# Altium schematic sheet IPMC_V71V01.SchDoc
size A2; SheetNumber: 1; SheetTotal: 1
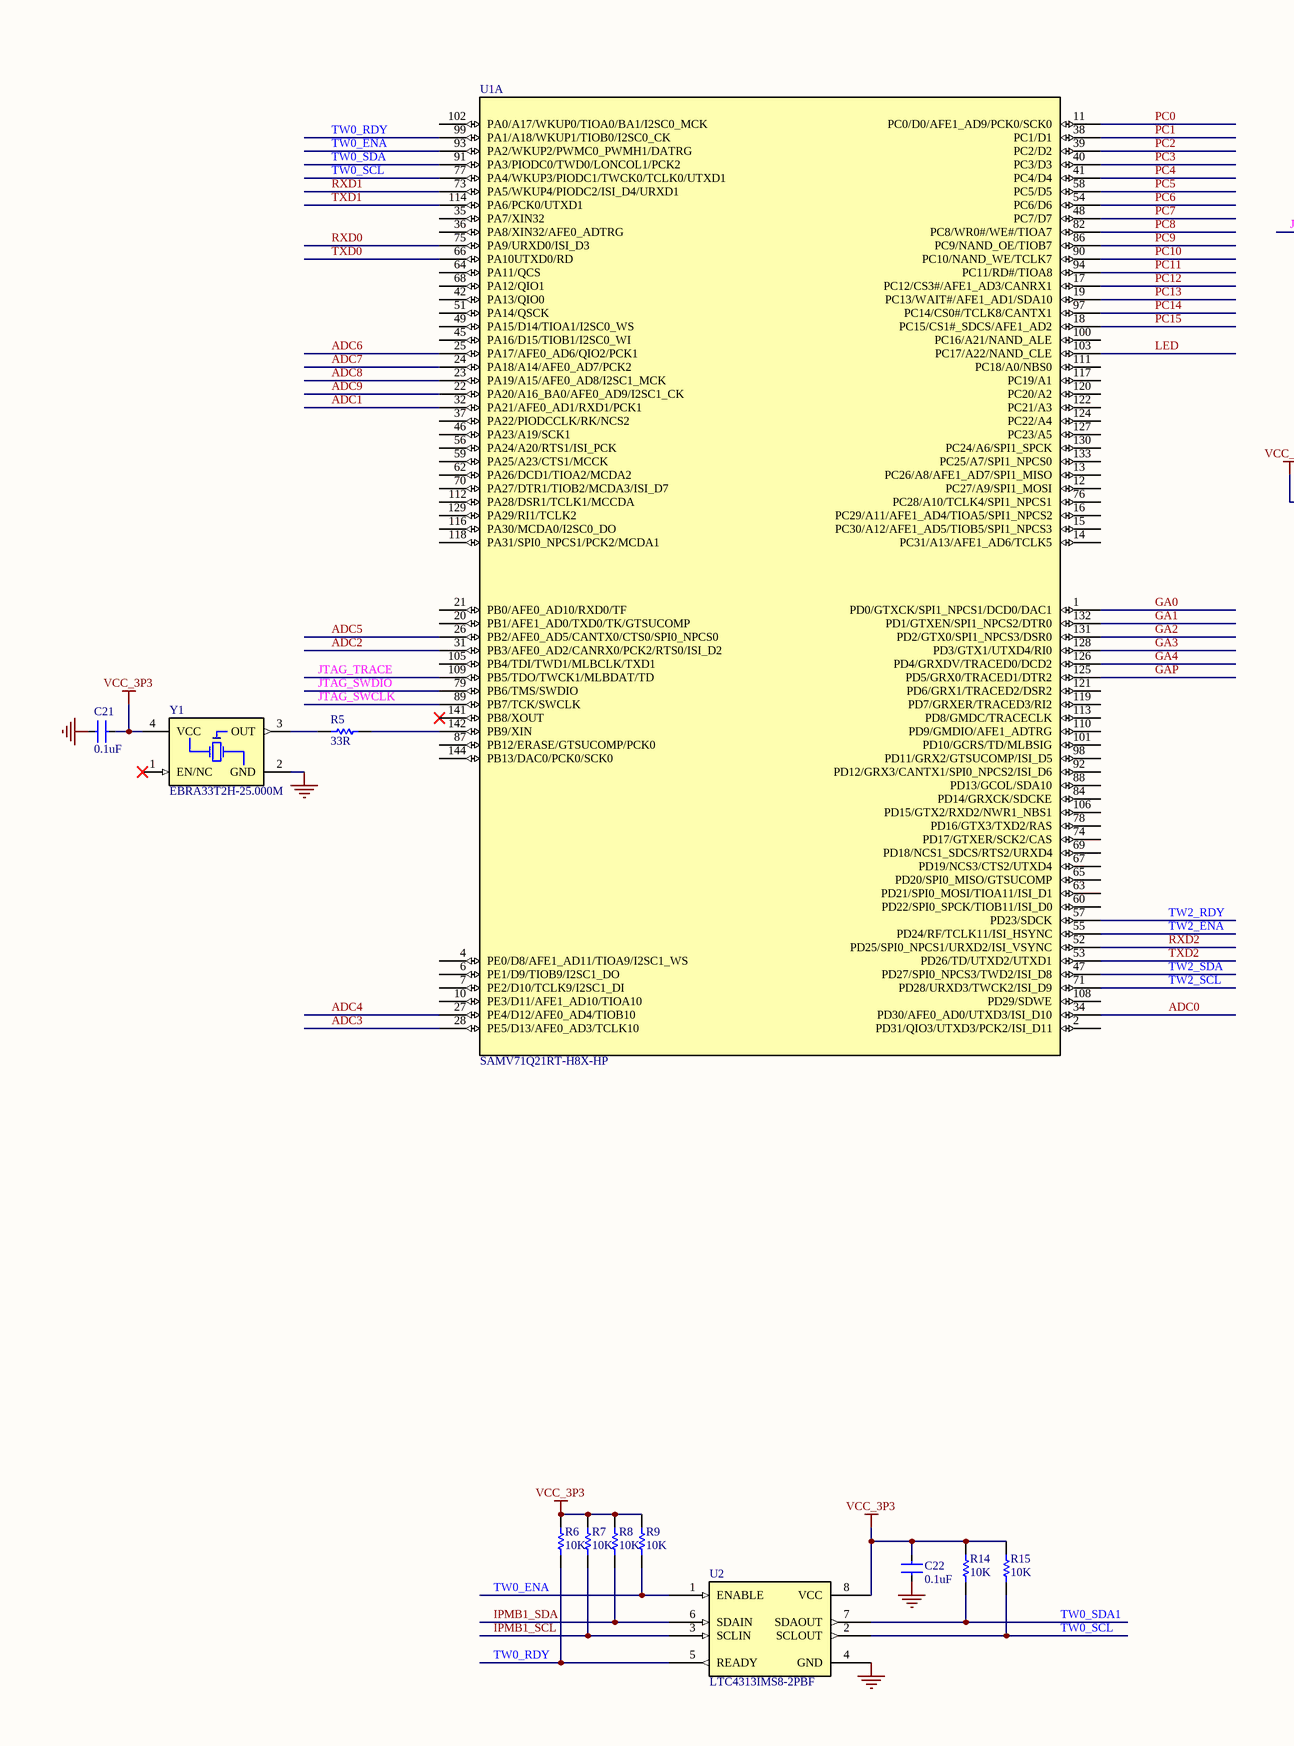
[diagram p0: IPMC_V71V01.SchDoc, left]
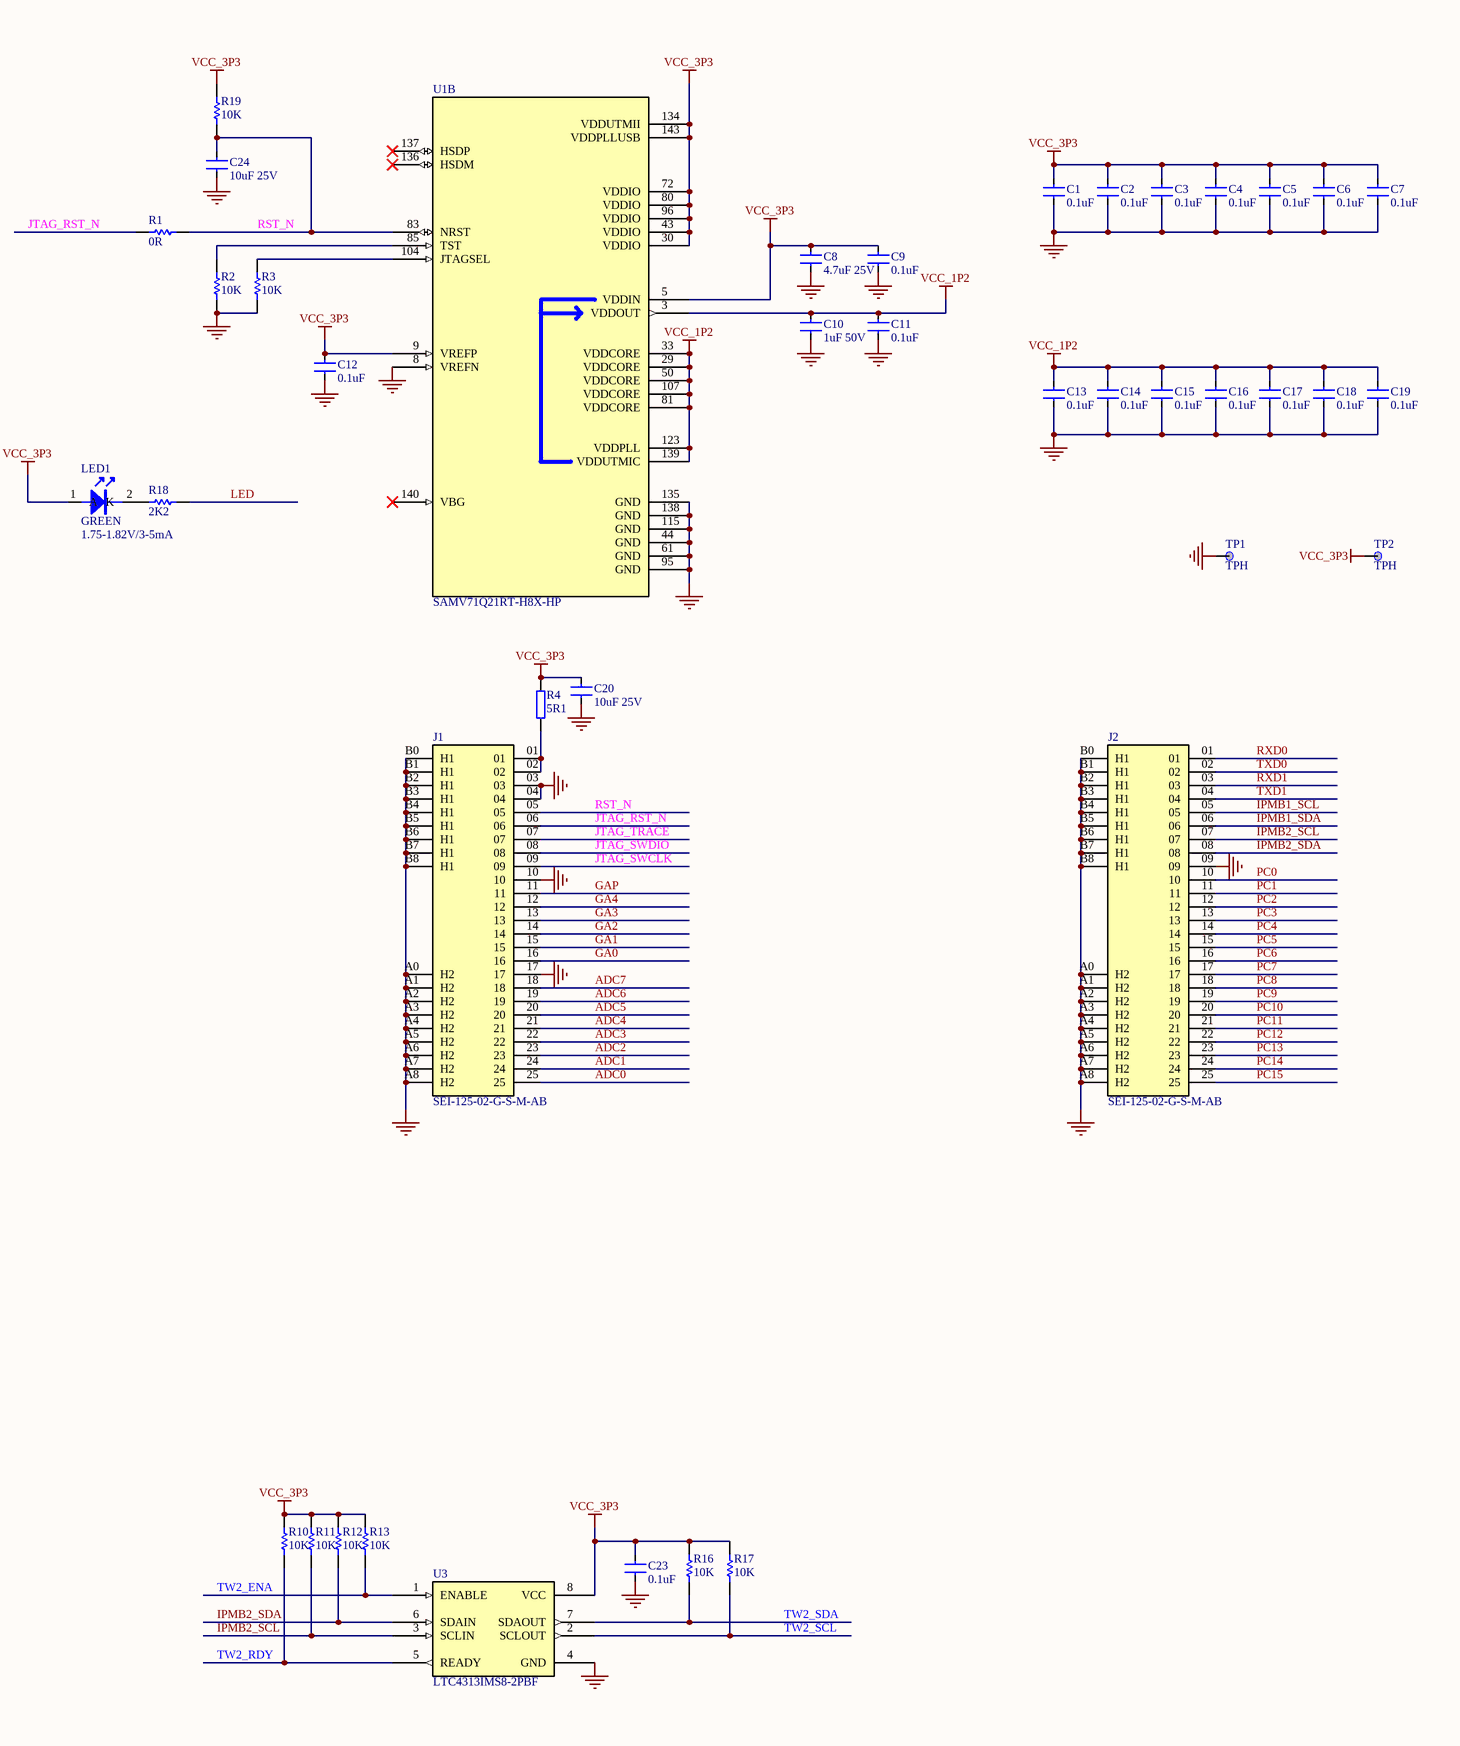
[diagram p1: IPMC_V71V01.SchDoc, right]

## Parts
C1  0.1uF  [0603C]
C2  0.1uF  [0603C]
C3  0.1uF  [0603C]
C4  0.1uF  [0603C]
C5  0.1uF  [0603C]
C6  0.1uF  [0603C]
C7  0.1uF  [0603C]
C8  4.7uF 25V  [0603C]
C9  0.1uF  [0603C]
C10  1uF 50V  [0603C]
C11  0.1uF  [0603C]
C12  0.1uF  [0603C]
C13  0.1uF  [0603C]
C14  0.1uF  [0603C]
C15  0.1uF  [0603C]
C16  0.1uF  [0603C]
C17  0.1uF  [0603C]
C18  0.1uF  [0603C]
C19  0.1uF  [0603C]
C20  10uF 25V  [0603C]
C21  0.1uF  [0603C]
C22  0.1uF  [0603C]
C23  0.1uF  [0603C]
C24  10uF 25V  [0603C]
J1  SEI-125-02-G-S-M-AB  [SAMTEC_SEI-125-02-G-S-M-AB_IPMC]
J2  SEI-125-02-G-S-M-AB  [SAMTEC_SEI-125-02-G-S-M-AB_IPMC]
LED1  GREEN  [0603LED]
R1  0R  [0603R]
R2  10K  [0603R]
R3  10K  [0603R]
R4  5R1  [0805R]
R5  33R  [0603R]
R6  10K  [0603R]
R7  10K  [0603R]
R8  10K  [0603R]
R9  10K  [0603R]
R10  10K  [0603R]
R11  10K  [0603R]
R12  10K  [0603R]
R13  10K  [0603R]
R14  10K  [0603R]
R15  10K  [0603R]
R16  10K  [0603R]
R17  10K  [0603R]
R18  2K2  [0603R]
R19  10K  [0603R]
TP1  TPH  [TP]
TP2  TPH  [TP]
U1  SAMV71Q21RT-H8X-HP  [LQFP144_2SB_MCH]  (parts A,B of 2)
U2  LTC4313IMS8-2PBF  [MSOP-8_MS_LIT]
U3  LTC4313IMS8-2PBF  [MSOP-8_MS_LIT]
Y1  EBRA33T2H-25.000M  [50.000M 3P3 50PPM 10PF 3.2*5.0MM]

## Nets
GND: C1.1 C2.1 C3.1 C4.1 C5.1 C6.1 C7.1 C8.1 C9.1 C10.1 C11.1 C12.1 C13.1 C14.1 C15.1 C16.1 C17.1 C18.1 C19.1 C20.2 C21.1 C22.2 C23.2 C24.1 J1.03 J1.04 J1.10 J1.17 J1.A0(H2) J1.A1(H2) J1.A2(H2) J1.A3(H2) J1.A4(H2) J1.A5(H2) J1.A6(H2) J1.A7(H2) J1.A8(H2) J1.B0(H1) J1.B1(H1) J1.B2(H1) J1.B3(H1) J1.B4(H1) J1.B5(H1) J1.B6(H1) J1.B7(H1) J1.B8(H1) J2.09 J2.A0(H2) J2.A1(H2) J2.A2(H2) J2.A3(H2) J2.A4(H2) J2.A5(H2) J2.A6(H2) J2.A7(H2) J2.A8(H2) J2.B0(H1) J2.B1(H1) J2.B2(H1) J2.B3(H1) J2.B4(H1) J2.B5(H1) J2.B6(H1) J2.B7(H1) J2.B8(H1) R2.1 R3.1 TP1.1 U1.8(VREFN) U1.44(GND) U1.61(GND) U1.95(GND) U1.115(GND) U1.135(GND) U1.138(GND) U2.4(GND) U3.4(GND) Y1.2(GND)
VCC_1P2: C10.2 C11.2 C13.2 C14.2 C15.2 C16.2 C17.2 C18.2 C19.2 U1.3(VDDOUT) U1.29(VDDCORE) U1.33(VDDCORE) U1.50(VDDCORE) U1.81(VDDCORE) U1.107(VDDCORE) U1.123(VDDPLL) U1.139(VDDUTMIC)
VCC_3P3: C1.2 C2.2 C3.2 C4.2 C5.2 C6.2 C7.2 C8.2 C9.2 C12.2 C20.1 C21.2 C22.1 C23.1 LED1.1(A) R4.2 R6.2 R7.2 R8.2 R9.2 R10.2 R11.2 R12.2 R13.2 R14.2 R15.2 R16.2 R17.2 R19.2 TP2.1 U1.5(VDDIN) U1.9(VREFP) U1.30(VDDIO) U1.43(VDDIO) U1.72(VDDIO) U1.80(VDDIO) U1.96(VDDIO) U1.134(VDDUTMII) U1.143(VDDPLLUSB) U2.8(VCC) U3.8(VCC) Y1.4(VCC)
ADC0: J1.25 U1.34(PD30/AFE0_AD0/UTXD3/ISI_D10)
ADC1: J1.24 U1.32(PA21/AFE0_AD1/RXD1/PCK1)
ADC2: J1.23 U1.31(PB3/AFE0_AD2/CANRX0/PCK2/RTS0/ISI_D2)
ADC3: J1.22 U1.28(PE5/D13/AFE0_AD3/TCLK10)
ADC4: J1.21 U1.27(PE4/D12/AFE0_AD4/TIOB10)
ADC5: J1.20 U1.26(PB2/AFE0_AD5/CANTX0/CTS0/SPI0_NPCS0)
ADC6: J1.19 U1.25(PA17/AFE0_AD6/QIO2/PCK1)
ADC7: J1.18 U1.24(PA18/A14/AFE0_AD7/PCK2)
ADC8: U1.23(PA19/A15/AFE0_AD8/I2SC1_MCK)
ADC9: U1.22(PA20/A16_BA0/AFE0_AD9/I2SC1_CK)
GA0: J1.16 U1.1(PD0/GTXCK/SPI1_NPCS1/DCD0/DAC1)
GA1: J1.15 U1.132(PD1/GTXEN/SPI1_NPCS2/DTR0)
GA2: J1.14 U1.131(PD2/GTX0/SPI1_NPCS3/DSR0)
GA3: J1.13 U1.128(PD3/GTX1/UTXD4/RI0)
GA4: J1.12 U1.126(PD4/GRXDV/TRACED0/DCD2)
GAP: J1.11 U1.125(PD5/GRX0/TRACED1/DTR2)
IPMB1_SCL: J2.05 R7.1 U2.3(SCLIN)
IPMB1_SDA: J2.06 R8.1 U2.6(SDAIN)
IPMB2_SCL: J2.07 R11.1 U3.3(SCLIN)
IPMB2_SDA: J2.08 R12.1 U3.6(SDAIN)
JTAG_RST_N: J1.06 R1.1
JTAG_SWCLK: J1.09 U1.89(PB7/TCK/SWCLK)
JTAG_SWDIO: J1.08 U1.79(PB6/TMS/SWDIO)
JTAG_TRACE: J1.07 U1.109(PB5/TDO/TWCK1/MLBDAT/TD)
LED: R18.2 U1.103(PC17/A22/NAND_CLE)
PC0: J2.10 U1.11(PC0/D0/AFE1_AD9/PCK0/SCK0)
PC1: J2.11 U1.38(PC1/D1)
PC2: J2.12 U1.39(PC2/D2)
PC3: J2.13 U1.40(PC3/D3)
PC4: J2.14 U1.41(PC4/D4)
PC5: J2.15 U1.58(PC5/D5)
PC6: J2.16 U1.54(PC6/D6)
PC7: J2.17 U1.48(PC7/D7)
PC8: J2.18 U1.82(PC8/WR0#/WE#/TIOA7)
PC9: J2.19 U1.86(PC9/NAND_OE/TIOB7)
PC10: J2.20 U1.90(PC10/NAND_WE/TCLK7)
PC11: J2.21 U1.94(PC11/RD#/TIOA8)
PC12: J2.22 U1.17(PC12/CS3#/AFE1_AD3/CANRX1)
PC13: J2.23 U1.19(PC13/WAIT#/AFE1_AD1/SDA10)
PC14: J2.24 U1.97(PC14/CS0#/TCLK8/CANTX1)
PC15: J2.25 U1.18(PC15/CS1#_SDCS/AFE1_AD2)
RST_N: C24.2 J1.05 R1.2 R19.1 U1.83(NRST)
RXD0: J2.01 U1.75(PA9/URXD0/ISI_D3)
RXD1: J2.03 U1.73(PA5/WKUP4/PIODC2/ISI_D4/URXD1)
RXD2: U1.52(PD25/SPI0_NPCS1/URXD2/ISI_VSYNC)
TW0_ENA: R9.1 U1.93(PA2/WKUP2/PWMC0_PWMH1/DATRG) U2.1(ENABLE)
TW0_RDY: R6.1 U1.99(PA1/A18/WKUP1/TIOB0/I2SC0_CK) U2.5(READY)
TW0_SCL: R15.1 U1.77(PA4/WKUP3/PIODC1/TWCK0/TCLK0/UTXD1) U2.2(SCLOUT)
TW0_SDA: U1.91(PA3/PIODC0/TWD0/LONCOL1/PCK2)
TW0_SDA1: R14.1 U2.7(SDAOUT)
TW2_ENA: R13.1 U1.55(PD24/RF/TCLK11/ISI_HSYNC) U3.1(ENABLE)
TW2_RDY: R10.1 U1.57(PD23/SDCK) U3.5(READY)
TW2_SCL: R17.1 U1.71(PD28/URXD3/TWCK2/ISI_D9) U3.2(SCLOUT)
TW2_SDA: R16.1 U1.47(PD27/SPI0_NPCS3/TWD2/ISI_D8) U3.7(SDAOUT)
TXD0: J2.02 U1.66(PA10UTXD0/RD)
TXD1: J2.04 U1.114(PA6/PCK0/UTXD1)
TXD2: U1.53(PD26/TD/UTXD2/UTXD1)
NetJ1_01: J1.01 J1.02 R4.1
NetLED1_2: LED1.2(K) R18.1
NetR2_2: R2.2 U1.85(TST)
NetR3_2: R3.2 U1.104(JTAGSEL)
NetR5_1: R5.1 Y1.3(OUT)
NetR5_2: R5.2 U1.142(PB9/XIN)

Not connected (* = marked no-connect by the designer): U1 2(PD31/QIO3/UTXD3/PCK2/ISI_D11) 4(PE0/D8/AFE1_AD11/TIOA9/I2SC1_WS) 6(PE1/D9/TIOB9/I2SC1_DO) 7(PE2/D10/TCLK9/I2SC1_DI) 10(PE3/D11/AFE1_AD10/TIOA10) 12(PC27/A9/SPI1_MOSI) 13(PC26/A8/AFE1_AD7/SPI1_MISO) 14(PC31/A13/AFE1_AD6/TCLK5) 15(PC30/A12/AFE1_AD5/TIOB5/SPI1_NPCS3) 16(PC29/A11/AFE1_AD4/TIOA5/SPI1_NPCS2) 20(PB1/AFE1_AD0/TXD0/TK/GTSUCOMP) 21(PB0/AFE0_AD10/RXD0/TF) 35(PA7/XIN32) 36(PA8/XIN32/AFE0_ADTRG) 37(PA22/PIODCCLK/RK/NCS2) 42(PA13/QIO0) 45(PA16/D15/TIOB1/I2SC0_WI) 46(PA23/A19/SCK1) 49(PA15/D14/TIOA1/I2SC0_WS) 51(PA14/QSCK) 56(PA24/A20/RTS1/ISI_PCK) 59(PA25/A23/CTS1/MCCK) 60(PD22/SPI0_SPCK/TIOB11/ISI_D0) 62(PA26/DCD1/TIOA2/MCDA2) 63(PD21/SPI0_MOSI/TIOA11/ISI_D1) 64(PA11/QCS) 65(PD20/SPI0_MISO/GTSUCOMP) 67(PD19/NCS3/CTS2/UTXD4) 68(PA12/QIO1) 69(PD18/NCS1_SDCS/RTS2/URXD4) 70(PA27/DTR1/TIOB2/MCDA3/ISI_D7) 74(PD17/GTXER/SCK2/CAS) 76(PC28/A10/TCLK4/SPI1_NPCS1) 78(PD16/GTX3/TXD2/RAS) 84(PD14/GRXCK/SDCKE) 87(PB12/ERASE/GTSUCOMP/PCK0) 88(PD13/GCOL/SDA10) 92(PD12/GRX3/CANTX1/SPI0_NPCS2/ISI_D6) 98(PD11/GRX2/GTSUCOMP/ISI_D5) 100(PC16/A21/NAND_ALE) 101(PD10/GCRS/TD/MLBSIG) 102(PA0/A17/WKUP0/TIOA0/BA1/I2SC0_MCK) 105(PB4/TDI/TWD1/MLBCLK/TXD1) 106(PD15/GTX2/RXD2/NWR1_NBS1) 108(PD29/SDWE) 110(PD9/GMDIO/AFE1_ADTRG) 111(PC18/A0/NBS0) 112(PA28/DSR1/TCLK1/MCCDA) 113(PD8/GMDC/TRACECLK) 116(PA30/MCDA0/I2SC0_DO) 117(PC19/A1) 118(PA31/SPI0_NPCS1/PCK2/MCDA1) 119(PD7/GRXER/TRACED3/RI2) 120(PC20/A2) 121(PD6/GRX1/TRACED2/DSR2) 122(PC21/A3) 124(PC22/A4) 127(PC23/A5) 129(PA29/RI1/TCLK2) 130(PC24/A6/SPI1_SPCK) 133(PC25/A7/SPI1_NPCS0) 136(HSDM)* 137(HSDP)* 140(VBG)* 141(PB8/XOUT)* 144(PB13/DAC0/PCK0/SCK0); Y1 1(EN/NC)*

## Library data of the parts
C1-C7 C9 C11-C19 = CAP-0.1u-100v-0603: X8L AEC-Q200; Manufacturer: muRata; PartNumber: GCJ188L8EL104KA07; VALUE: 0.1uF 100v 0603; TYPE: X8L AEC-Q200
C8 = CAP-4.7u-25v-0603: X5R AEC-Q200; PartNumber: GRT188R61E475KE13; Manufacturer: muRata; TYPE: X5R AEC-Q200; VALUE: 4.7uF 25V
C10 = CAP-1u-50v-0603: X5R AEC-Q200; PartNumber: GRT188R61H105KE13; Manufacturer: muRata; TYPE: X5R AEC-Q200; VALUE: 1uF 50V
C20 C24 = CAP-10u-25v-0603: X5R AEC-Q200; PartNumber: GRT188R61E106ME13; Manufacturer: muRata; TYPE: X5R AEC-Q200; VALUE: 10uF 25V
C21-C23 = CAP-0.1u-50v-0603: X7R AEC-Q200; PartNumber: GCJ188R71H104KA12; Manufacturer: muRata; VALUE: 0.1uF 50V 0603; TYPE: X7R AEC-Q200
J1 J2 = SEI-125-02-G-S-E-AB: 25 Position Spring Compression Contact, Non-Gendered Connector Surface Mount; MF: Samtec; SnapEDA_Link: https://www.snapeda.com/parts/SEI-125-02-G-S-E-AB/Samtec/view-part/?ref=snap; Package: None; Value: *; MP: SEI-125-02-G-S-E-AB; Check_prices: https://www.snapeda.com/parts/SEI-125-02-G-S-E-AB/Samtec/view-part/?ref=eda
LED1 = D-LED0603-GREEN: 1.75-1.82V/3-5mA; PartNumber: *; Manufacturer: *; TYPE: *; Parameter 1: 1.75-1.82V/3-5mA
R1 = Res1-0R: 1%/0603; PartNumber: AC0603FR-070RL; Manufacturer: YAGEO; VALUE: 0R 1% 0603; TYPE: Q-200
R2 R3 R6-R17 R19 = Res1-10K: 1%/0603; PartNumber: AC0603FR-0710KL; Manufacturer: YAGEO; VALUE: 10K 1% 0603; TYPE: Q-200
R4 = Res2-5R1-0805: 1%/0805; PartNumber: AC0805FR-075R1L; Manufacturer: YAGEO; VALUE: 5R1 1% 0805 1/8W; TYPE: Q-200
R5 = Res1-33R: 1%/0603; PartNumber: AC0603FR-0733RL; Manufacturer: YAGEO; VALUE: 33R/0.01W/Q200; TYPE: Q-200
R18 = Res1-2K2: 1%/0603; PartNumber: AC0603FR-072K2L; Manufacturer: YAGEO; VALUE: 2K 1% 0603; TYPE: Q-200
U1 = SAMV71Q21RT-H8X-HP: No Description Available; Mfr_Name: Microchip; RefDes: RefDes; Type: Type
U2 U3 = LTC4313IMS8-1PBF: No Description Available; Mfr_Name: Analog Devices Inc; RefDes: RefDes; Type: Type
Y1 = XTAL3_50M_SPXO_3.2_5.0: SPXO AEC-Q200; Manufacturer: Ecliptec; PartNumber: EBRA23T1H-50.000M; VALUE: 50.000M 3P3 50ppm 10pF 3.2*5.0MM; TYPE: XO SPXO AEC-Q200